# Altium schematic sheet Controller.SchDoc
size A4; SheetNumber: 1; SheetTotal: 1
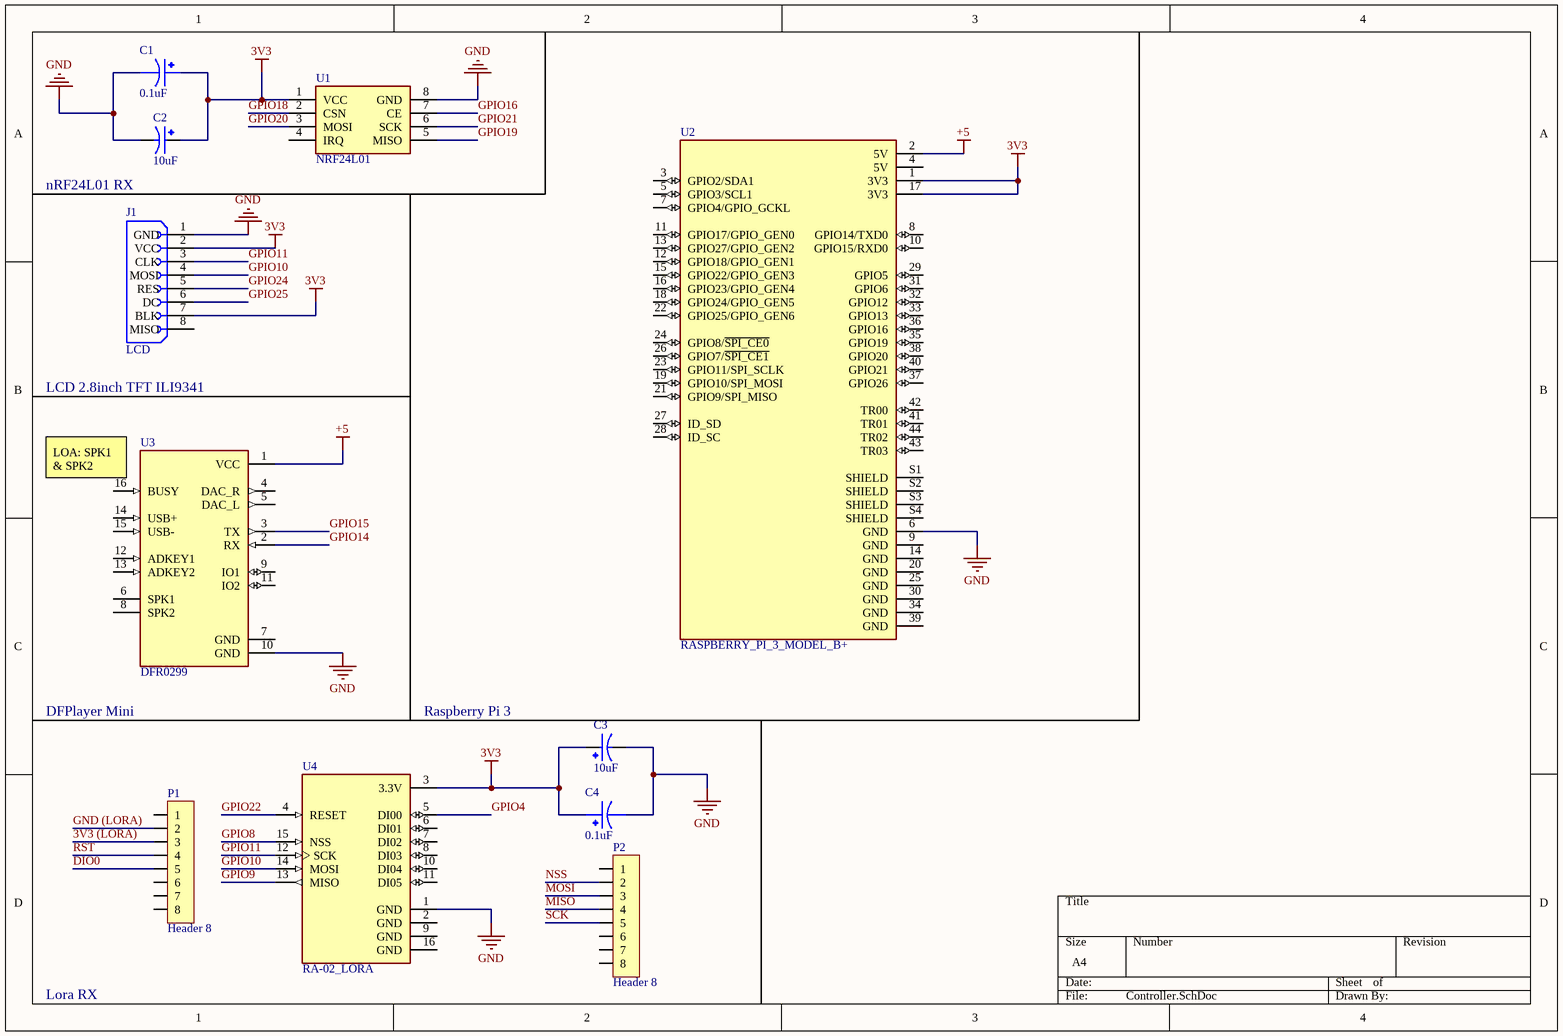
[diagram p0: Controller.SchDoc]

## Parts
C1  0.1uF  [CAPPRD200W50D550H1250]
C2  10uF  [CAPPRD500W50D500H1100]
C3  10uF  [CAPPRD500W50D500H1100]
C4  0.1uF  [CAPPRD200W50D550H1250]
J1  LCD  [GRAVITECH_8FX1-254MM]
P1  Header 8  [HDR/Header/8]
P2  Header 8  [HDR/Header/8]
U1  NRF24L01  [NRF24L01]
U2  RASPBERRY_PI_3_MODEL_B+  [MODULE_RASPBERRY_PI_3_MODEL_B+]
U3  DFR0299  [MODULE_DFR0299]
U4  RA-02_LORA  [MODULE_RA-02_LORA]

## Nets
3V3: C1.1 C2.P C3.P C4.1 J1.2(VCC) J1.7(BLK) U1.1(VCC) U2.1(3V3) U2.17(3V3) U4.3(3.3V)
+5: U2.2(5V) U3.1(VCC)
GND: C1.2 C2.N C3.N C4.2 J1.1(GND) U1.8(GND) U2.6(GND) U3.10(GND) U4.1(GND)
3V3 (LORA): P1.3
DIO0: P1.5
GND (LORA): P1.2
GPIO4: U4.5(DI00)
GPIO8: U4.15(NSS)
GPIO9: U4.13(MISO)
GPIO10: J1.4(MOSI) U4.14(MOSI)
GPIO11: J1.3(CLK) U4.12(SCK)
GPIO14: U3.2(RX)
GPIO15: U3.3(TX)
GPIO16: U1.7(CE)
GPIO18: U1.2(CSN)
GPIO19: U1.5(MISO)
GPIO20: U1.3(MOSI)
GPIO21: U1.6(SCK)
GPIO22: U4.4(RESET)
GPIO24: J1.5(RES)
GPIO25: J1.6(DC)
MISO: P2.4
MOSI: P2.3
NSS: P2.2
RST: P1.4
SCK: P2.5

Not connected (* = marked no-connect by the designer): J1 8(MISO); P1 1 6 7 8; P2 1 6 7 8; U1 4(IRQ); U2 3(GPIO2/SDA1) 4(5V) 5(GPIO3/SCL1) 7(GPIO4/GPIO_GCKL) 8(GPIO14/TXD0) 9(GND) 10(GPIO15/RXD0) 11(GPIO17/GPIO_GEN0) 12(GPIO18/GPIO_GEN1) 13(GPIO27/GPIO_GEN2) 14(GND) 15(GPIO22/GPIO_GEN3) 16(GPIO23/GPIO_GEN4) 18(GPIO24/GPIO_GEN5) 19(GPIO10/SPI_MOSI) 20(GND) 21(GPIO9/SPI_MISO) 22(GPIO25/GPIO_GEN6) 23(GPIO11/SPI_SCLK) 24(GPIO8/~{SPI_CE0}) 25(GND) 26(GPIO7/~{SPI_CE1}) 27(ID_SD) 28(ID_SC) 29(GPIO5) 30(GND) 31(GPIO6) 32(GPIO12) 33(GPIO13) 34(GND) 35(GPIO19) 36(GPIO16) 37(GPIO26) 38(GPIO20) 39(GND) 40(GPIO21) 41(TR01) 42(TR00) 43(TR03) 44(TR02) S1(SHIELD) S2(SHIELD) S3(SHIELD) S4(SHIELD); U3 4(DAC_R) 5(DAC_L) 6(SPK1) 7(GND) 8(SPK2) 9(IO1) 11(IO2) 12(ADKEY1) 13(ADKEY2) 14(USB+) 15(USB-) 16(BUSY); U4 2(GND) 6(DI01) 7(DI02) 8(DI03) 9(GND) 10(DI04) 11(DI05) 16(GND)

## Notes on the sheet
- nRF24L01 RX
- LCD 2.8inch TFT ILI9341
- (near U3) LOA: SPK1 & SPK2
- (near U3) DFPlayer Mini
- Raspberry Pi 3
- Lora RX

## Library data of the parts
C1 C4 = UVR2A0R1MDD: 0.1 ÂµF 100 V Aluminum Electrolytic Capacitors Radial, Can - 2000 Hrs @ 85Â°C; MF: Nichicon; SnapEDA_Link: https://www.snapeda.com/parts/UVR2A0R1MDD/Nichicon/view-part/?ref=snap; Package: Radial Nichicon; Value: *; MP: UVR2A0R1MDD; Check_prices: https://www.snapeda.com/parts/UVR2A0R1MDD/Nichicon/view-part/?ref=eda
C2 C3 = ECA1JM100B: 10ÂµF 63V Aluminum Electrolytic Capacitors Radial, Can 2000 Hrs @ 85Â°C; MF: Panasonic; SnapEDA_Link: https://www.snapeda.com/parts/ECA1JM100B/Panasonic/view-part/?ref=snap; Package: RADIAL-2 Panasonic; Value: *; MP: ECA1JM100B; Check_prices: https://www.snapeda.com/parts/ECA1JM100B/Panasonic/view-part/?ref=eda
J1 = 8FX1-254MM: Headers & Wire Housings 2.54MM 0.1 8-PIN FEMALE HEADER; MF: Gravitech; MP: 8Fx1-254mm; SnapEDA_Link: https://www.snapeda.com/parts/8Fx1-254mm/Gravitech/view-part/?ref=snap; Price: None; Purchase-URL: https://pricing.snapeda.com/search/part/8Fx1-254mm/?ref=eda; Package: None; Availability: In Stock; Check_prices: https://www.snapeda.com/parts/8Fx1-254mm/Gravitech/view-part/?ref=eda; Value: *
P1 P2 = Header 8: Header, 8-Pin
U1 = NRF24L01: MÓDULO TRANSCEPTOR RF WIRELESS 2.4GHZ
U2 = RASPBERRY_PI_3_MODEL_B+: Case Plastic, ABS Black Hand Held, Split Sides 3.520 L x 2.740 W (89.41mm x 69.60mm) X 0.980 (24.89mm); MF: Raspberry Pi; MP: RASPBERRY PI 3 MODEL B+; Purchase-URL: https://pricing.snapeda.com/search/part/RASPBERRY PI 3 MODEL B+/?ref=eda; Check_prices: https://www.snapeda.com/parts/RASPBERRY%20PI%203%20MODEL%20B+/Raspberry+Pi/view-part/?ref=eda; SnapEDA_Link: https://www.snapeda.com/parts/RASPBERRY%20PI%203%20MODEL%20B+/Raspberry+Pi/view-part/?ref=snap; Price: None; Availability: In Stock; Package: Raspberry Pi; Value: *
U3 = DFR0299: - MP3 Player Audio Arduino Platform Evaluation Expansion Board; MF: DFRobot; SnapEDA_Link: https://www.snapeda.com/parts/DFR0299/DFRobot/view-part/?ref=snap; Package: None; Value: *; MP: DFR0299; Check_prices: https://www.snapeda.com/parts/DFR0299/DFRobot/view-part/?ref=eda
U4 = RA-02_LORA: Ra-02 LoRa RF M5Stack Platform Evaluation Expansion Board; Price: None; Availability: Unavailable; MP: RA-02_LORA; Value: *; Package: None